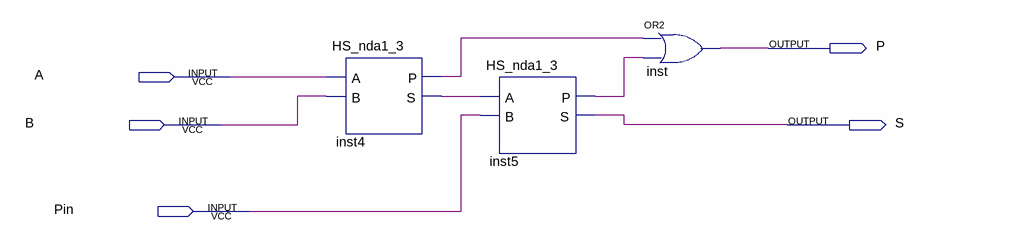
[diagram p0: schematic sheet]
// Quartus schematic SM_nda1_3.bdf as structural Verilog: 3 symbols, 5 pins
module SM_nda1_3 (
  input  A,
  input  B,
  input  Pin,
  output P,
  output S
);

  wire inst4_p, inst4_s, inst5_p;

  HS_nda1_3 inst4 (.A(A), .B(B), .P(inst4_p), .S(inst4_s));
  HS_nda1_3 inst5 (.A(inst4_s), .B(Pin), .P(inst5_p), .S(S));
  or inst (P, inst4_p, inst5_p);
endmodule
